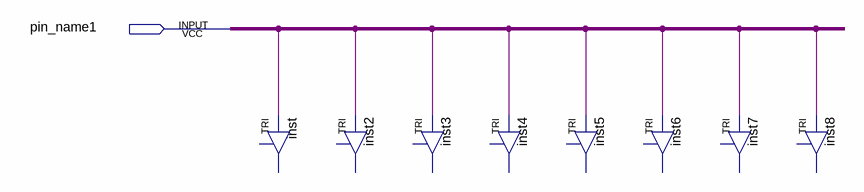
[diagram p0: schematic sheet]
// Quartus schematic Tri_state_8bit.bdf as structural Verilog: 8 symbols, 1 pins
module Tri_state_8bit (
  input  pin_name1
);

  TRI inst (.IN(pin_name1));  // open: OE, OUT
  TRI inst2 (.IN(pin_name1));  // open: OE, OUT
  TRI inst3 (.IN(pin_name1));  // open: OE, OUT
  TRI inst4 (.IN(pin_name1));  // open: OE, OUT
  TRI inst5 (.IN(pin_name1));  // open: OE, OUT
  TRI inst6 (.IN(pin_name1));  // open: OE, OUT
  TRI inst7 (.IN(pin_name1));  // open: OE, OUT
  TRI inst8 (.IN(pin_name1));  // open: OE, OUT
endmodule
